# Altium schematic sheet EDU_High-Speed-Design_CPU_Ethernet.SchDoc: CPU Ethernet
size 279 x 215 mm; Date: not used; ApprovedBy: not used; CheckedBy: not used; Author: not used; DrawnBy: not used; Organization: not used; Address4: not used; SheetNumber: 17; SheetTotal: 26; Time: not used; ImagePath: not used; Application_BuildNumber: not used
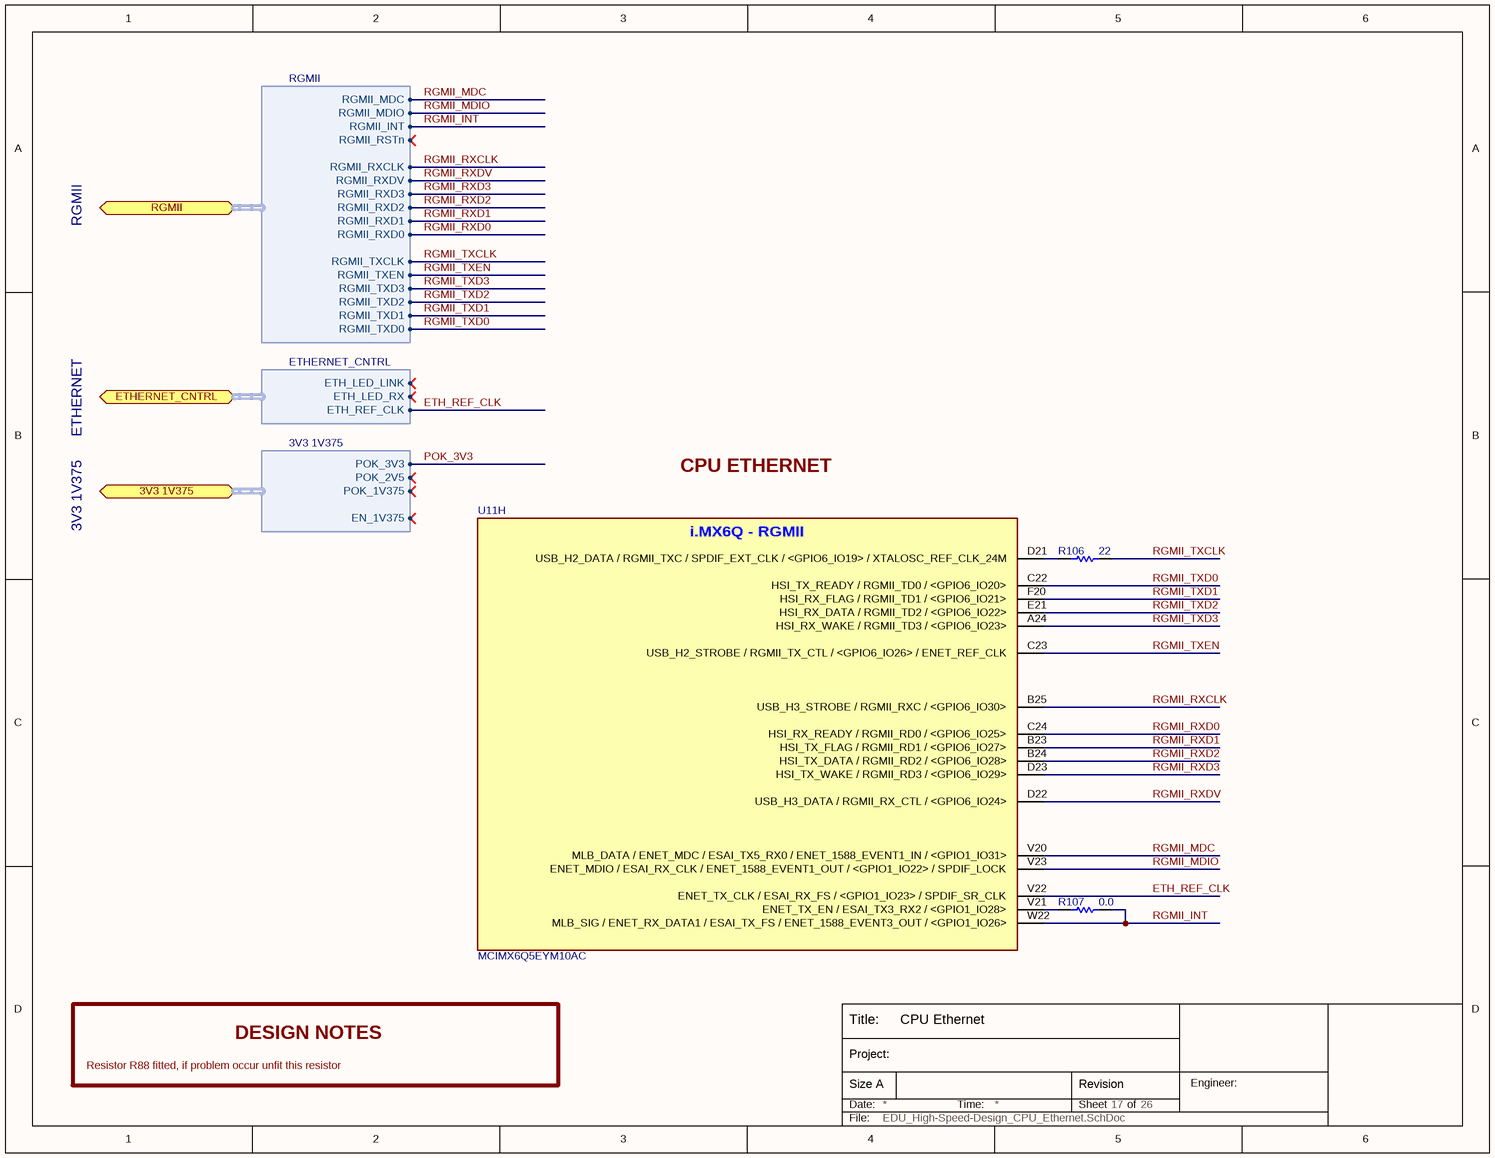
[diagram p0: EDU_High-Speed-Design_CPU_Ethernet.SchDoc]

## Parts
R106  22  [R0402]
R107  0.0  [R0402]
U11  MCIMX6Q5EYM10AC  [MCIMX6Q5EYM10AC]  (part H of 15)

## Ports
3V3 1V375 (bidir, harness 3V3 1V375), ETHERNET_CNTRL (bidir, harness ETHERNET_CNTRL), RGMII (bidir, harness RGMII)

## Harnesses
RGMII: RGMII_TXCLK, RGMII_TXEN, RGMII_TXD2, RGMII_TXD0, RGMII_TXD1, RGMII_TXD3, RGMII_RXDV, RGMII_RXCLK, RGMII_RXD3, RGMII_RXD2, RGMII_RXD1, RGMII_RXD0, RGMII_RSTn, RGMII_INT, RGMII_MDIO, RGMII_MDC
ETHERNET_CNTRL: ETH_LED_LINK, ETH_REF_CLK, ETH_LED_RX
3V3 1V375: POK_3V3, POK_1V375, POK_2V5, EN_1V375

## Nets
ETH_REF_CLK: U11.V22(ENET_TX_CLK_/_ESAI_RX_FS_/_<GPIO1_IO23>_/_SPDIF_SR_CLK) ; port ETHERNET_CNTRL.ETH_REF_CLK
POK_3V3: port 3V3 1V375.POK_3V3
RGMII_INT: R107.1 U11.W22(MLB_SIG_/_ENET_RX_DATA1_/_ESAI_TX_FS_/_ENET_1588_EVENT3_OUT_/_<GPIO1_IO26>) ; port RGMII.RGMII_INT
RGMII_MDC: U11.V20(MLB_DATA_/_ENET_MDC_/_ESAI_TX5_RX0_/_ENET_1588_EVENT1_IN_/_<GPIO1_IO31>) ; port RGMII.RGMII_MDC
RGMII_MDIO: U11.V23(ENET_MDIO_/_ESAI_RX_CLK_/_ENET_1588_EVENT1_OUT_/_<GPIO1_IO22>_/_SPDIF_LOCK) ; port RGMII.RGMII_MDIO
RGMII_RXCLK: U11.B25(USB_H3_STROBE_/_RGMII_RXC_/_<GPIO6_IO30>) ; port RGMII.RGMII_RXCLK
RGMII_RXD0: U11.C24(HSI_RX_READY_/_RGMII_RD0_/_<GPIO6_IO25>) ; port RGMII.RGMII_RXD0
RGMII_RXD1: U11.B23(HSI_TX_FLAG_/_RGMII_RD1_/_<GPIO6_IO27>) ; port RGMII.RGMII_RXD1
RGMII_RXD2: U11.B24(HSI_TX_DATA_/_RGMII_RD2_/_<GPIO6_IO28>) ; port RGMII.RGMII_RXD2
RGMII_RXD3: U11.D23(HSI_TX_WAKE_/_RGMII_RD3_/_<GPIO6_IO29>) ; port RGMII.RGMII_RXD3
RGMII_RXDV: U11.D22(USB_H3_DATA_/_RGMII_RX_CTL_/_<GPIO6_IO24>) ; port RGMII.RGMII_RXDV
RGMII_TXCLK: R106.1 ; port RGMII.RGMII_TXCLK
RGMII_TXD0: U11.C22(HSI_TX_READY_/_RGMII_TD0_/_<GPIO6_IO20>) ; port RGMII.RGMII_TXD0
RGMII_TXD1: U11.F20(HSI_RX_FLAG_/_RGMII_TD1_/_<GPIO6_IO21>) ; port RGMII.RGMII_TXD1
RGMII_TXD2: U11.E21(HSI_RX_DATA_/_RGMII_TD2_/_<GPIO6_IO22>) ; port RGMII.RGMII_TXD2
RGMII_TXD3: U11.A24(HSI_RX_WAKE_/_RGMII_TD3_/_<GPIO6_IO23>) ; port RGMII.RGMII_TXD3
RGMII_TXEN: U11.C23(USB_H2_STROBE_/_RGMII_TX_CTL_/_<GPIO6_IO26>_/_ENET_REF_CLK) ; port RGMII.RGMII_TXEN
NetR106_2: R106.2 U11.D21(USB_H2_DATA_/_RGMII_TXC_/_SPDIF_EXT_CLK_/_<GPIO6_IO19>_/_XTALOSC_REF_CLK_24M)
NetR107_2: R107.2 U11.V21(ENET_TX_EN_/_ESAI_TX3_RX2_/_<GPIO1_IO28>)

## Notes on the sheet
- RGMII
- ETHERNET
- CPU ETHERNET
- 3V3 1V375
- DESIGN NOTES
- Resistor R88 fitted, if problem occur unfit this resistor
- Title:
- Date:
- Size A
- Project:
- Time:
- Sheet
- Revision
- of
- Engineer:
- File:
- (in symbol MCIMX6Q5EYM10AC, part H) i.MX6Q - RGMII

## Library data of the parts
R106 = RC0402FR-0722RL: RES 22.0 OHM 1/16W 1% 0402 SMD; Manufacturer 1: Yageo; Manufacturer Part Number 1: RC0402FR-0722RL; Resistance: 22; Supplier 1: Digi-Key; Supplier Part Number 1: 311-22.0LRCT-ND; ComponentLink1URL: http://www.yageo.com/documents/recent/PYu-RC0402_51_RoHS_L_6.pdf; ComponentLink1Description: http://www.yageo.com/documents/recent/PYu-RC0402_51_RoHS_L_6.pdf
R107 = RC0402JR-070RL: RES 0.0 OHM 1/16W 0402 SMD; Manufacturer 1: Yageo; Manufacturer Part Number 1: RC0402JR-070RL; Resistance: 0.0; Supplier 1: Digi-Key; Supplier Part Number 1: 311-0.0JRCT-ND; ComponentLink1URL: http://www.yageo.com/documents/recent/PYu-RC0402_51_RoHS_L_6.pdf; ComponentLink1Description: http://www.yageo.com/documents/recent/PYu-RC0402_51_RoHS_L_6.pdf
U11 = MCIMX6Q5EYM10AC: IC MCU 32BIT ARM QUAD 624FCBGA; Manufacturer 1: Freescale Semiconductor; Supplier 1: Digi-Key; Manufacturer Part Number 1: MCIMX6Q5EYM10AC; Supplier Part Number 1: MCIMX6Q5EYM10AC-ND